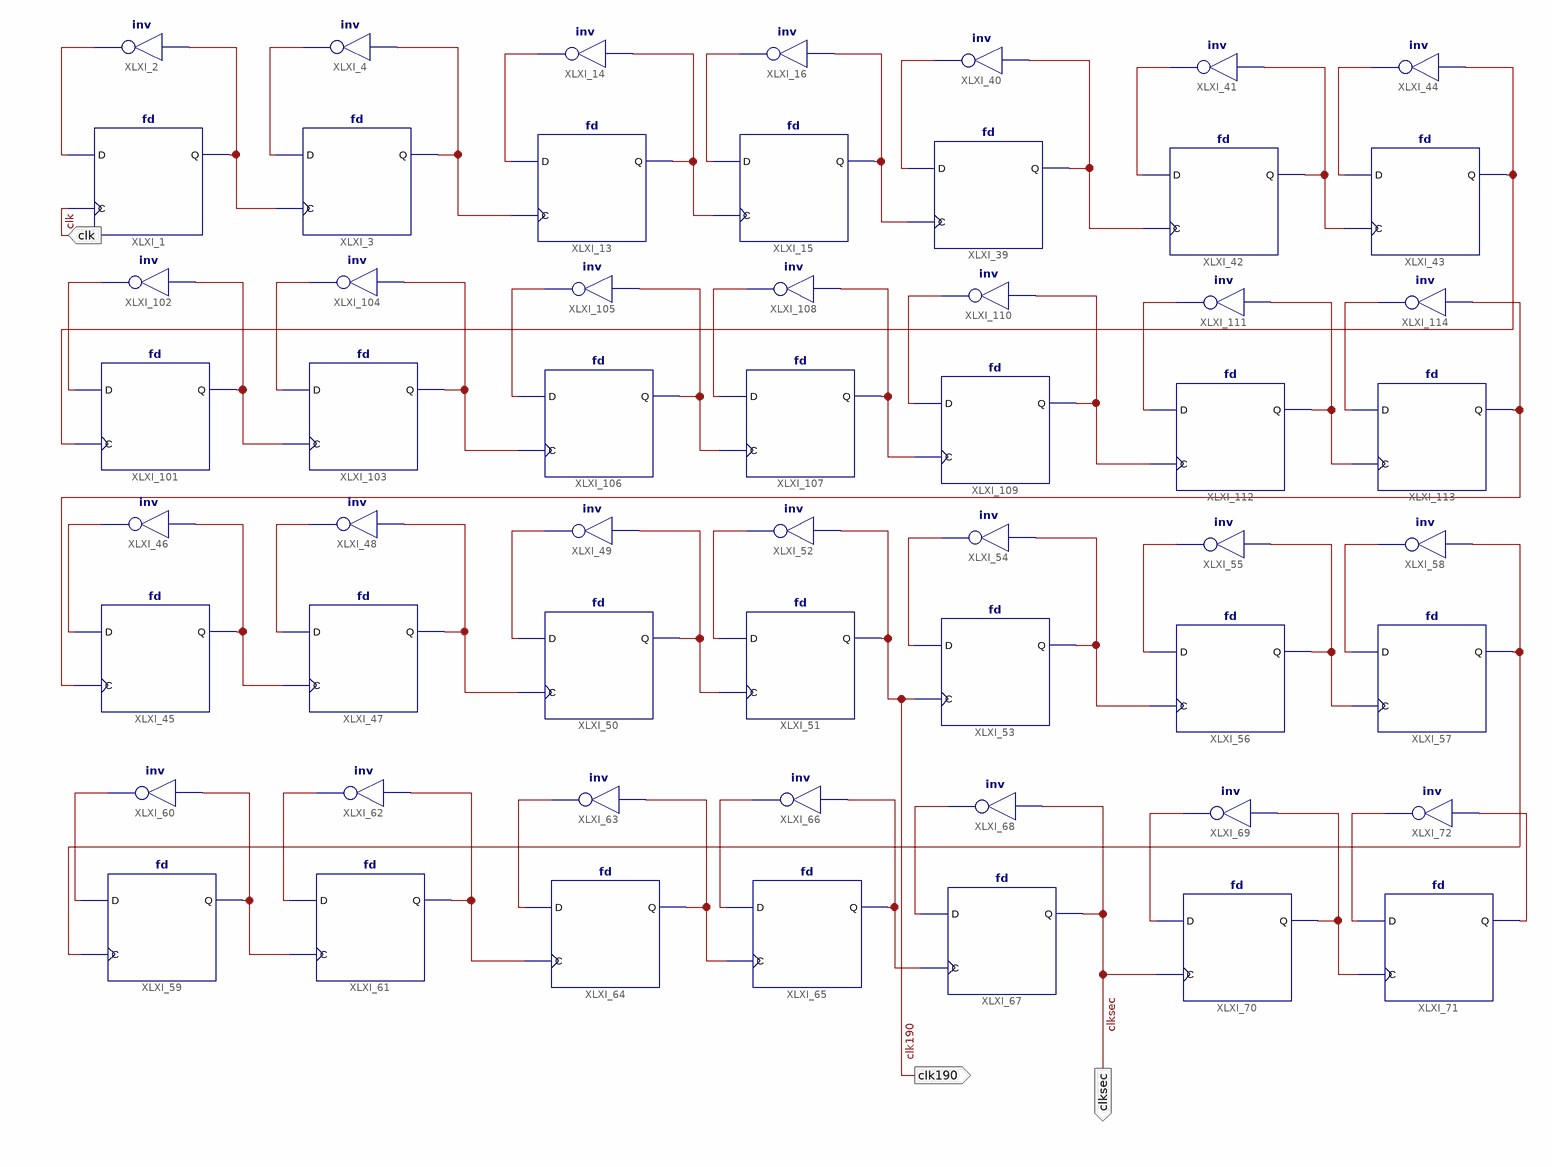
[diagram p0: schematic sheet 1]
// Xilinx ISE schematic clkdiv.sch (spartan3e) as structural Verilog: 56 symbols, 3 ports
module clkdiv (
  input  clk,
  output clksec,
  output clk190
);

  wire XLXN_1, XLXN_2, XLXN_3, XLXN_4, XLXN_16, XLXN_17, XLXN_18, XLXN_19, XLXN_44, XLXN_45, XLXN_46,
       XLXN_47, XLXN_49, XLXN_51, XLXN_52, XLXN_53, XLXN_54, XLXN_55, XLXN_56, XLXN_58, XLXN_59, XLXN_60,
       XLXN_61, XLXN_62, XLXN_63, XLXN_64, XLXN_65, XLXN_66, XLXN_67, XLXN_68, XLXN_69, XLXN_70, XLXN_71,
       XLXN_72, XLXN_73, XLXN_74, XLXN_76, XLXN_77, XLXN_78, XLXN_115, XLXN_116, XLXN_117, XLXN_118,
       XLXN_119, XLXN_120, XLXN_121, XLXN_122, XLXN_123, XLXN_124, XLXN_125, XLXN_126, XLXN_152, XLXN_154,
       XLXN_156;

  fd XLXI_1 (.C(clk), .D(XLXN_2), .Q(XLXN_1));
  not XLXI_2 (XLXN_2, XLXN_1);
  fd XLXI_3 (.C(XLXN_1), .D(XLXN_4), .Q(XLXN_3));
  not XLXI_4 (XLXN_4, XLXN_3);
  not XLXI_14 (XLXN_17, XLXN_16);
  fd XLXI_13 (.C(XLXN_3), .D(XLXN_17), .Q(XLXN_16));
  fd XLXI_15 (.C(XLXN_16), .D(XLXN_19), .Q(XLXN_18));
  not XLXI_16 (XLXN_19, XLXN_18);
  fd XLXI_39 (.C(XLXN_18), .D(XLXN_44), .Q(XLXN_46));
  not XLXI_40 (XLXN_44, XLXN_46);
  not XLXI_41 (XLXN_47, XLXN_45);
  fd XLXI_42 (.C(XLXN_46), .D(XLXN_47), .Q(XLXN_45));
  fd XLXI_43 (.C(XLXN_45), .D(XLXN_49), .Q(XLXN_152));
  not XLXI_44 (XLXN_49, XLXN_152);
  fd XLXI_45 (.C(XLXN_154), .D(XLXN_52), .Q(XLXN_51));
  not XLXI_46 (XLXN_52, XLXN_51);
  fd XLXI_47 (.C(XLXN_51), .D(XLXN_53), .Q(XLXN_55));
  not XLXI_48 (XLXN_53, XLXN_55);
  not XLXI_49 (XLXN_56, XLXN_54);
  fd XLXI_50 (.C(XLXN_55), .D(XLXN_56), .Q(XLXN_54));
  fd XLXI_51 (.C(XLXN_54), .D(XLXN_58), .Q(clk190));
  not XLXI_52 (XLXN_58, clk190);
  fd XLXI_53 (.C(clk190), .D(XLXN_59), .Q(XLXN_61));
  not XLXI_54 (XLXN_59, XLXN_61);
  not XLXI_55 (XLXN_62, XLXN_60);
  fd XLXI_56 (.C(XLXN_61), .D(XLXN_62), .Q(XLXN_60));
  fd XLXI_57 (.C(XLXN_60), .D(XLXN_64), .Q(XLXN_63));
  not XLXI_58 (XLXN_64, XLXN_63);
  fd XLXI_59 (.C(XLXN_63), .D(XLXN_66), .Q(XLXN_65));
  not XLXI_60 (XLXN_66, XLXN_65);
  fd XLXI_61 (.C(XLXN_65), .D(XLXN_67), .Q(XLXN_69));
  not XLXI_62 (XLXN_67, XLXN_69);
  not XLXI_63 (XLXN_70, XLXN_68);
  fd XLXI_64 (.C(XLXN_69), .D(XLXN_70), .Q(XLXN_68));
  fd XLXI_65 (.C(XLXN_68), .D(XLXN_72), .Q(XLXN_71));
  not XLXI_66 (XLXN_72, XLXN_71);
  fd XLXI_67 (.C(XLXN_71), .D(XLXN_73), .Q(clksec));
  not XLXI_68 (XLXN_73, clksec);
  not XLXI_69 (XLXN_76, XLXN_74);
  fd XLXI_70 (.C(clksec), .D(XLXN_76), .Q(XLXN_74));
  fd XLXI_71 (.C(XLXN_74), .D(XLXN_78), .Q(XLXN_77));
  not XLXI_72 (XLXN_78, XLXN_77);
  fd XLXI_101 (.C(XLXN_152), .D(XLXN_116), .Q(XLXN_115));
  not XLXI_102 (XLXN_116, XLXN_115);
  fd XLXI_103 (.C(XLXN_115), .D(XLXN_117), .Q(XLXN_119));
  not XLXI_104 (XLXN_117, XLXN_119);
  not XLXI_105 (XLXN_120, XLXN_118);
  fd XLXI_106 (.C(XLXN_119), .D(XLXN_120), .Q(XLXN_118));
  fd XLXI_107 (.C(XLXN_118), .D(XLXN_121), .Q(XLXN_156));
  not XLXI_108 (XLXN_121, XLXN_156);
  fd XLXI_109 (.C(XLXN_156), .D(XLXN_122), .Q(XLXN_124));
  not XLXI_110 (XLXN_122, XLXN_124);
  not XLXI_111 (XLXN_125, XLXN_123);
  fd XLXI_112 (.C(XLXN_124), .D(XLXN_125), .Q(XLXN_123));
  fd XLXI_113 (.C(XLXN_123), .D(XLXN_126), .Q(XLXN_154));
  not XLXI_114 (XLXN_126, XLXN_154);
endmodule
